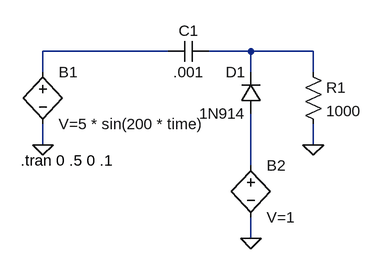
[diagram p0: schematic PosClamp.asc]
PosClamp.asc, the LTspice schematic file:
Version 4
SHEET 1 880 680
WIRE 96 64 -96 64
WIRE 224 64 160 64
WIRE 320 64 224 64
WIRE -96 96 -96 64
WIRE 224 96 224 64
WIRE 320 96 320 64
WIRE -96 208 -96 176
WIRE 320 208 320 176
WIRE 224 240 224 160
WIRE 224 352 224 320
FLAG -96 208 0
FLAG 320 208 0
FLAG 224 352 0
SYMBOL diode 240 160 R180
WINDOW 0 24 64 Left 2
WINDOW 3 24 0 Left 2
SYMATTR InstName D1
SYMATTR Value 1N914
SYMBOL res 304 80 R0
SYMATTR InstName R1
SYMATTR Value 1000
SYMBOL cap 160 48 R90
WINDOW 0 0 32 VBottom 2
WINDOW 3 32 32 VTop 2
SYMATTR InstName C1
SYMATTR Value .001
SYMBOL bv -96 80 R0
SYMATTR InstName B1
SYMATTR Value V=5 * sin(200 * time)
SYMBOL bv 224 224 R0
SYMATTR InstName B2
SYMATTR Value V=1
TEXT -130 232 Left 2 !.tran 0 .5 0 .1

The netlist it stands for:
* PosClamp.asc
D1 N003 N002 1N914
R1 N002 0 1000
C1 N002 N001 .001
B1 N001 0 V=5 * sin(200 * time)
B2 N003 0 V=1
.model D D
.lib standard.dio
.tran 0 .5 0 .1
.backanno
.end